# EAGLE design ptSolar (EAGLE 6.6.0)
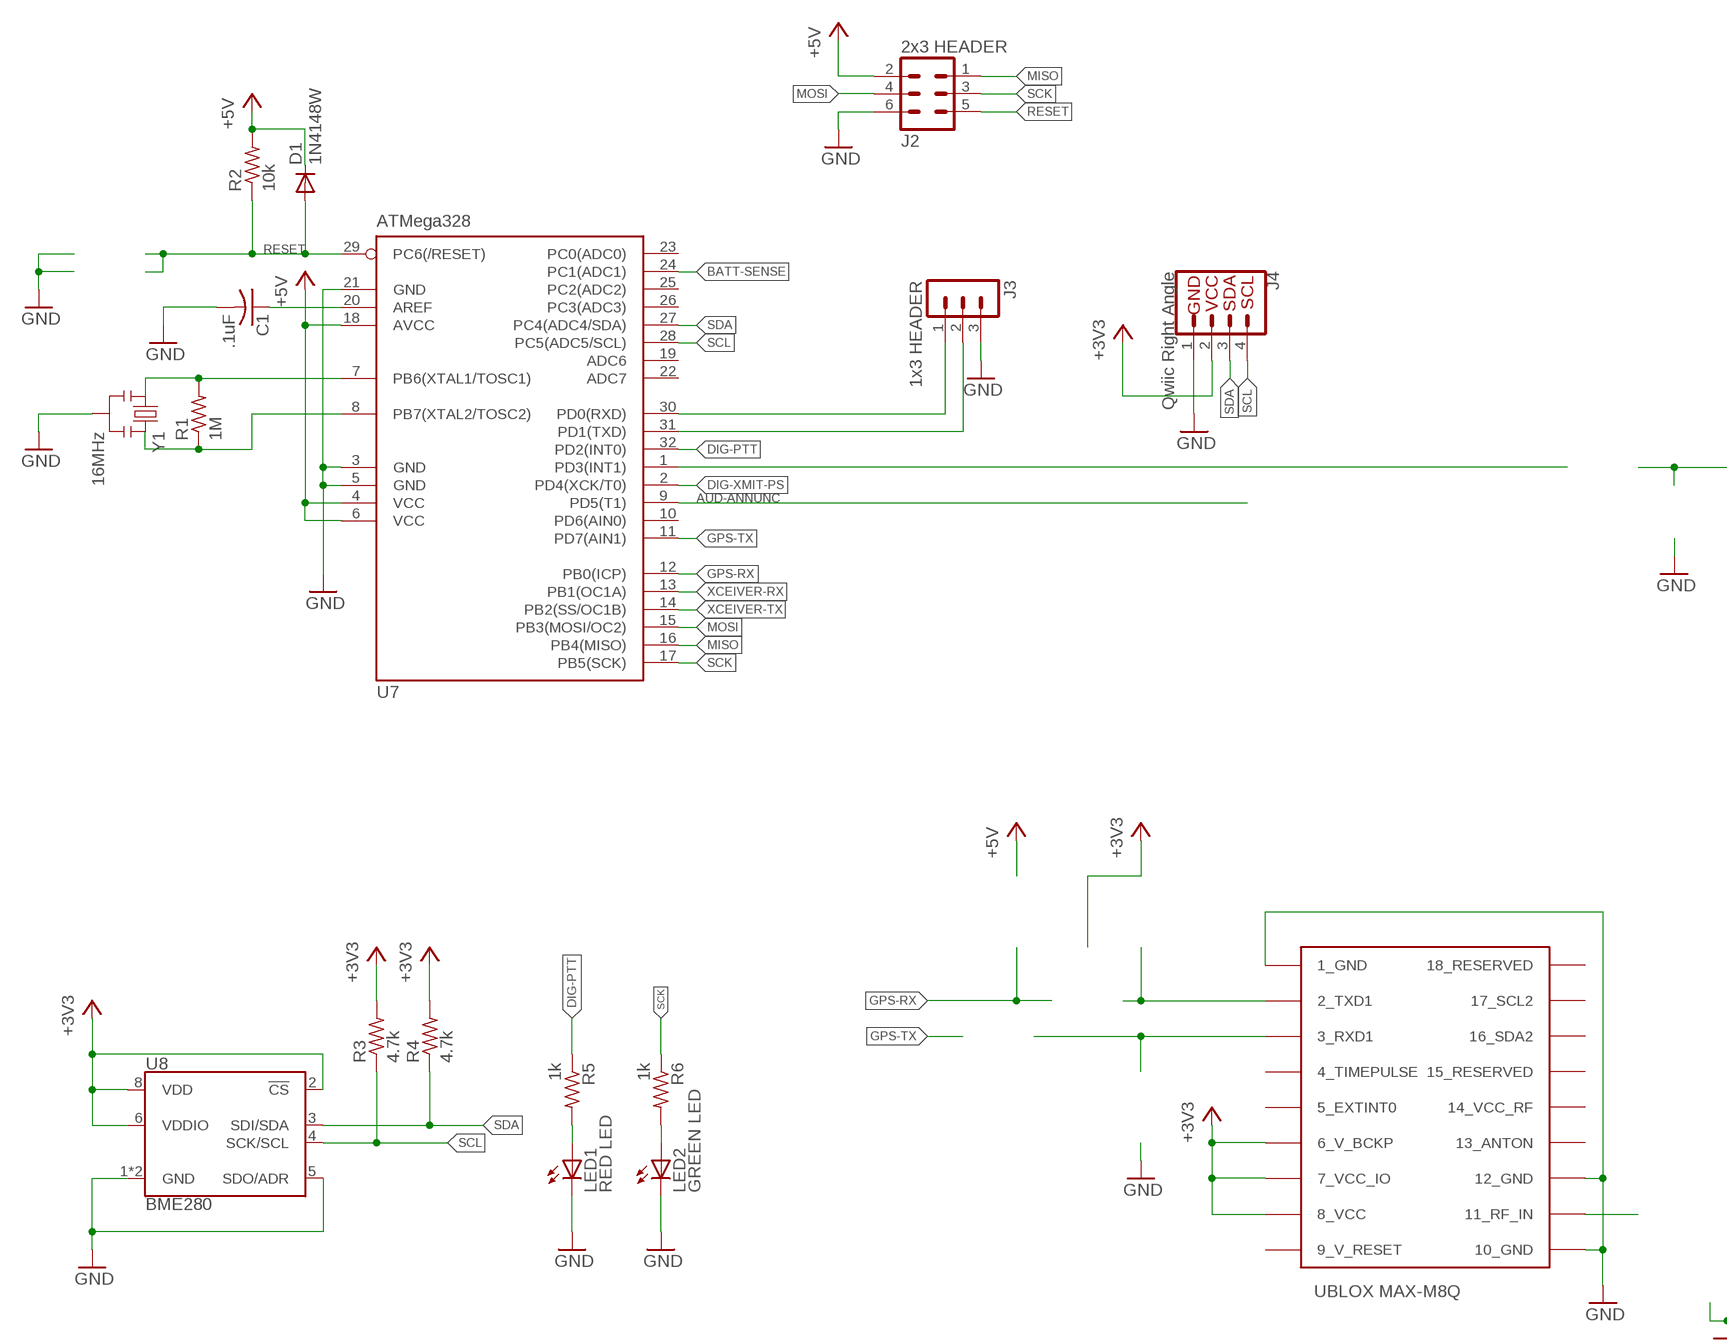
[diagram p0: schematic, sheet 1, part 1 of 2]
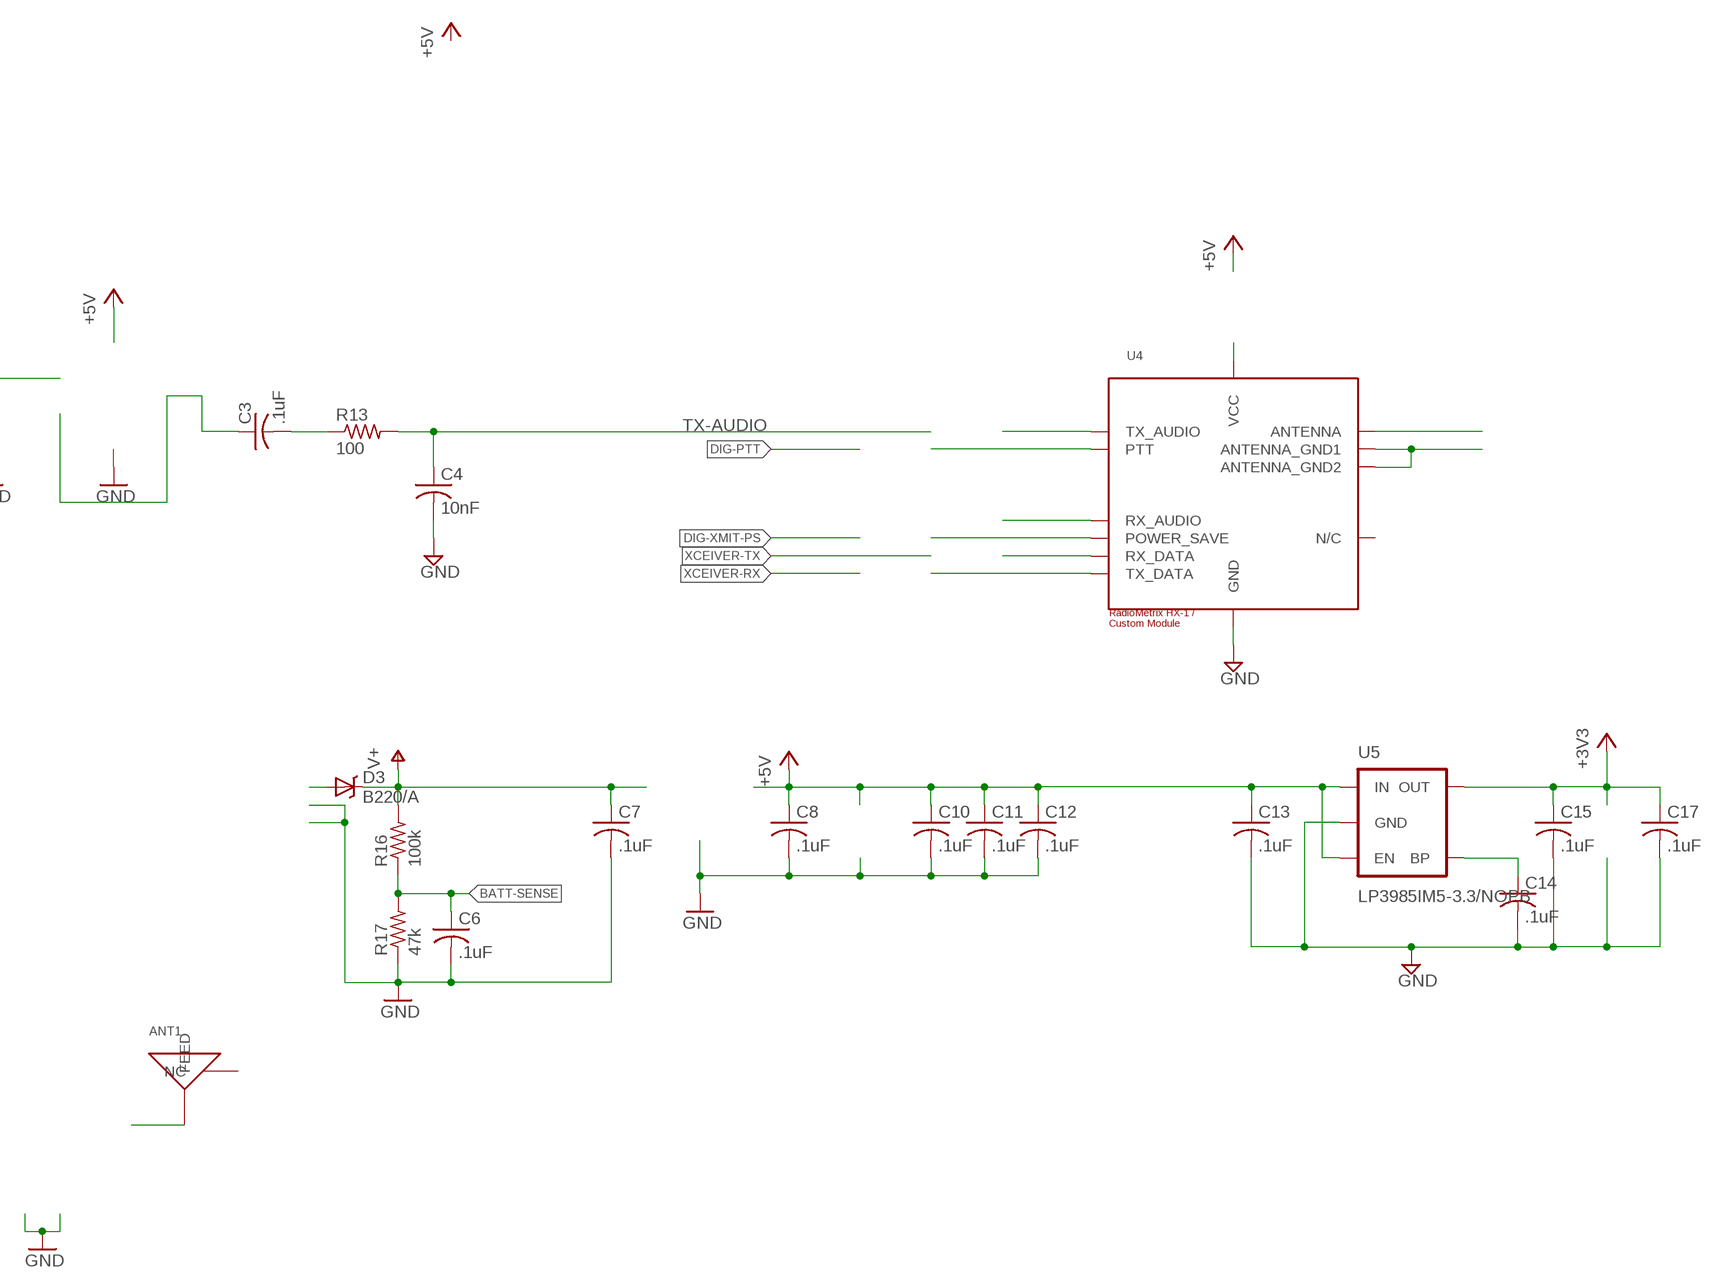
[diagram p1: schematic, sheet 1, part 2 of 2]

## Parts
ANT1  GPS ANTENNA  GPS_ANT_SMDBAR  [1575AT43A40]
C1  .1uF  C-USC0805  [C0805]
C3  .1uF  C-USC0805  [C0805]
C4  10nF  C-USC0805  [C0805]
C6  .1uF  C-USC0805  [C0805]
C7  .1uF  C-USC0805  [C0805]
C8  .1uF  C-USC0805  [C0805]
C10  .1uF  C-USC0805  [C0805]
C11  .1uF  C-USC0805  [C0805]
C12  .1uF  C-USC0805  [C0805]
C13  .1uF  C-USC0805  [C0805]
C14  .1uF  C-USC0805  [C0805]
C15  .1uF  C-USC0805  [C0805]
C17  .1uF  C-USC0805  [C0805]
D1  1N4148W  DIODE-SOD123  [SOD123]
D3  B220/A  B340A  [SMA-DIODE]
J2  2x3 HEADER  MA03-2  [MA03-2]
J3  1x3 HEADER  MA03-1  [MA03-1]
J4  Qwiic Right Angle  I2C_STANDARDQWIIC  [1X04_1MM_RA]
LED1  RED LED  LEDCHIPLED_1206  [CHIPLED_1206]
LED2  GREEN LED  LEDCHIPLED_1206  [CHIPLED_1206]
R1  1M  R-US_R0805  [R0805]
R2  10k  R-US_R0805  [R0805]
R3  4.7k  R-US_R0805  [R0805]
R4  4.7k  R-US_R0805  [R0805]
R5  1k  R-US_R0805  [R0805]
R6  1k  R-US_R0805  [R0805]
R13  100  R-US_R0805  [R0805]
R16  100k  R-US_R0805  [R0805]
R17  47k  R-US_R0805  [R0805]
U2  UBLOX_MAX  [UBLOX_MAX]
U4  RADIOMETRIX-HX1-CUSTOM  [RADIOMETRIX-HX1-CUSTOM]
U5  LP3985IM5-3.3/NOPB  V_REG_LDOSMD  [SOT23-5]
U7  ATMega328  MEGA8-AI  [TQFP32-08]
U8  BME280  [LGA-8-2.5X2.5]
Y1  16MHz  RESONATOR16MHZ  [RESONATOR-SMD]

## Nets
+3V3: C15.1 C17.1 J4.2 R3.2 R4.2 U2.6_V_BCKP U2.7_VCC_IO U2.8_VCC U5.5(OUT) U8.2(!CS) U8.6(VDDIO) U8.8(VDD)
+5V [Power]: C8.1 C10.1 C11.1 C12.1 C13.1 D1.C J2.2 R2.2 U5.1(IN) U5.3(EN) U7.4(VCC) U7.6(VCC) U7.18(AVCC)
AUD-ANNUNC: U7.9(PD5(T1))
BATT-SENSE: C6.1 R16.1 R17.2 U7.24(PC1(ADC1))
DIG-PTT: R5.1 U7.32(PD2(INT0))
DIG-XMIT-PS: U7.2(PD4(XCK/T0))
GND [Power]: C1.2 C4.2 C6.2 C7.2 C8.2 C10.2 C11.2 C12.2 C13.2 C14.2 C15.2 C17.2 J2.6 J3.3 J4.1 LED1.C LED2.C R17.1 U2.1_GND U2.10_GND U2.12_GND U4.GND U5.2(GND) U7.3(GND) U7.5(GND) U7.21(GND) U8.1(GND) U8.5(SDO/ADR) U8.7(GND) Y1.2
GPS-RX: U7.12(PB0(ICP))
GPS-TX: U7.11(PD7(AIN1))
MISO: J2.1 U7.16(PB4(MISO))
MOSI: J2.4 U7.15(PB3(MOSI/OC2))
N$2: U2.11_RF_IN
N$3: ANT1.FEED
N$4: U4.ANTENNA
N$5: U4.TX_AUDIO
N$7: U4.PTT
N$8: D3.A
N$10: C4.1 R13.2
N$11: C3.1
N$12: U4.RX_AUDIO
N$13: U7.1(PD3(INT1))
N$14: U4.POWER_SAVE
N$15: U2.2_TXD1
N$17: R1.1 U7.8(PB7(XTAL2/TOSC2)) Y1.3
N$18: U2.3_RXD1
N$19: U4.RX_DATA
N$20: U4.TX_DATA
N$23: LED1.A R5.2
N$25: LED2.A R6.2
N$59: C1.1 U7.20(AREF)
N$60: C14.1 U5.4(BP)
N$64: R1.2 U7.7(PB6(XTAL1/TOSC1)) Y1.1
RESET: D1.A J2.5 R2.1 U7.29(PC6(/RESET))
RFGND: U4.ANTENNA_GND1 U4.ANTENNA_GND2
RXD: J3.1 U7.30(PD0(RXD))
SCK: J2.3 R6.1 U7.17(PB5(SCK))
SCL: J4.4 R3.1 U7.28(PC5(ADC5/SCL)) U8.4(SCK/SCL)
SDA: J4.3 R4.1 U7.27(PC4(ADC4/SDA)) U8.3(SDI/SDA)
TX-AUDIO: C3.2 R13.1
TXD: J3.2 U7.31(PD1(TXD))
V+ [Power]: C7.1 D3.C R16.2
VCC: U4.VCC
XCEIVER-RX: U7.13(PB1(OC1A))
XCEIVER-TX: U7.14(PB2(SS/OC1B))
Unconnected: ANT1.NC U2.4_TIMEPULSE U2.5_EXTINT0 U2.13_ANTON U2.14_VCC_RF U2.15_RESERVED U2.16_SDA2 U2.17_SCL2 U2.18_RESERVED U4.N/C1(N/C) U4.N/C2(N/C) U4.N/C3(N/C) U4.N/C4(N/C) U7.10(PD6(AIN0)) U7.19(ADC6) U7.22(ADC7) U7.23(PC0(ADC0)) U7.25(PC2(ADC2)) U7.26(PC3(ADC3))

## Power pins joined to a net without a drawn wire
9_V_RESET: U2.9_V_RESET

## Library data of the parts
ANT1 = Parts:GPS_ANT_SMDBAR: 1.575 GHz GPS Antenna Johanson Technology http://www.digikey.com/product-detail/en/1575AT43A0040E/712-1003-1-ND/1560832; DIGIKEY: 712-1003-1-ND
C1 C3 C6-C8 C10-C15 C17 = resistor:C-US: CAPACITOR, American symbol; DIGIKEY: 311-1361-1-ND
C4 = resistor:C-US: CAPACITOR, American symbol; DIGIKEY: 399-1158-1-ND
D1 = custom-ds:DIODE-: DIODE; DIGIKEY: 1N4148W-FDICT-ND
D3 = SparkFun-DiscreteSemi:B340A: Schottky Diode 3A-40V; DIGIKEY: 641-1258-1-ND; PROD_ID: DIO-09886; VALUE: BA340A
J2 = con-lstb:MA03-2: PIN HEADER; DIGIKEY: 952-2121-ND; OC_FARNELL: unknown; OC_NEWARK: unknown
J3 = con-lstb:MA03-1: PIN HEADER; DIGIKEY: 952-2264-ND; OC_FARNELL: unknown; OC_NEWARK: unknown
J4 = SparkFun-Connectors:I2C_STANDARD: SparkFun I2C Standard Pinout Header SparkFun has standardized on a pinout for all I2C based sensor breakouts. This pinout allows I2C boards to be plugged directly into the headers on Arduino Uno compatible boards, and to be daisy chained easily. Example SparkFun Products: SparkFun Atmospheric Sensor Breakout - BME280 <https://www.sparkfun.com/products/13676> SparkFun Altitude/Pressure Sensor Breakout - MPL3115A2 <https://www.sparkfun.com/products/11084> SparkFun TOF Range Finder Sensor - VL6180 <https://www.sparkfun.com/products/12785>; DIGIKEY: 455-1804-1-ND; PROD_ID: CONN-13694
LED1 = led:LED: LED OSRAM: - CHIPLED LG R971, LG N971, LY N971, LG Q971, LY Q971, LO R971, LY R971 LH N974, LH R974 LS Q976, LO Q976, LY Q976 LO Q996 - Hyper CHIPLED LW Q18S LB Q993, LB Q99A, LB R99A - SideLED LS A670, LO A670, LY A670, LG A670, LP A670 LB A673, LV A673, LT A673, LW A673 LH A674 LY A675 LS A676, LA A676, LO A676, LY A676, LW A676 LS A679, LY A679, LG A679 - Hyper Micro SIDELED® LS Y876, LA Y876, LO Y876, LY Y876 LT Y87S - SmartLED LW L88C, LW L88S LB L89C, LB L89S, LG L890 LS L89K, LO L89K, LY L89K LS L896, LA L896, LO L896, LY L896 - TOPLED LS T670, LO T670, LY T670, LG T670, LP T670 LSG T670, LSP T670, LSY T670, LOP T670, LYG T670 LG T671, LOG T671, LSG T671 LB T673, LV T673, LT T673, LW T673 LH T674 LS T676, LA T676, LO T676, LY T676, LB T676, LH T676, LSB T676, LW T676 LB T67C, LV T67C, LT T67C, LS T67K, LO T67K, LY T67K, LW E67C LS E67B, LA E67B, LO E67B, LY E67B, LB E67C, LV E67C, LT E67C LW T67C LS T679, LY T679, LG T679 LS T770, LO T770, LY T770, LG T770, LP T770 LB T773, LV T773, LT T773, LW T773 LH T774 LS E675, LA E675, LY E675, LS T675 LS T776, LA T776, LO T776, LY T776, LB T776 LHGB T686 LT T68C, LB T68C - Hyper Mini TOPLED® LB M676 - Mini TOPLED Santana® LG M470 LS M47K, LO M47K, LY M47K Source: http://www.osram.convergy.de LUXEON: - LUMILED® LXK2-PW12-R00, LXK2-PW12-S00, LXK2-PW14-U00, LXK2-PW14-V00 LXK2-PM12-R00, LXK2-PM12-S00, LXK2-PM14-U00 LXK2-PE12-Q00, LXK2-PE12-R00, LXK2-PE12-S00, LXK2-PE14-T00, LXK2-PE14-U00 LXK2-PB12-K00, LXK2-PB12-L00, LXK2-PB12-M00, LXK2-PB14-N00, LXK2-PB14-P00, LXK2-PB14-Q00 LXK2-PR12-L00, LXK2-PR12-M00, LXK2-PR14-Q00, LXK2-PR14-R00 LXK2-PD12-Q00, LXK2-PD12-R00, LXK2-PD12-S00 LXK2-PH12-R00, LXK2-PH12-S00 LXK2-PL12-P00, LXK2-PL12-Q00, LXK2-PL12-R00 Source: www.luxeon.com KINGBRIGHT: KA-3528ASYC Source: www.kingbright.com; DIGIKEY: 160-1405-1-ND
LED2 = led:LED: LED OSRAM: - CHIPLED LG R971, LG N971, LY N971, LG Q971, LY Q971, LO R971, LY R971 LH N974, LH R974 LS Q976, LO Q976, LY Q976 LO Q996 - Hyper CHIPLED LW Q18S LB Q993, LB Q99A, LB R99A - SideLED LS A670, LO A670, LY A670, LG A670, LP A670 LB A673, LV A673, LT A673, LW A673 LH A674 LY A675 LS A676, LA A676, LO A676, LY A676, LW A676 LS A679, LY A679, LG A679 - Hyper Micro SIDELED® LS Y876, LA Y876, LO Y876, LY Y876 LT Y87S - SmartLED LW L88C, LW L88S LB L89C, LB L89S, LG L890 LS L89K, LO L89K, LY L89K LS L896, LA L896, LO L896, LY L896 - TOPLED LS T670, LO T670, LY T670, LG T670, LP T670 LSG T670, LSP T670, LSY T670, LOP T670, LYG T670 LG T671, LOG T671, LSG T671 LB T673, LV T673, LT T673, LW T673 LH T674 LS T676, LA T676, LO T676, LY T676, LB T676, LH T676, LSB T676, LW T676 LB T67C, LV T67C, LT T67C, LS T67K, LO T67K, LY T67K, LW E67C LS E67B, LA E67B, LO E67B, LY E67B, LB E67C, LV E67C, LT E67C LW T67C LS T679, LY T679, LG T679 LS T770, LO T770, LY T770, LG T770, LP T770 LB T773, LV T773, LT T773, LW T773 LH T774 LS E675, LA E675, LY E675, LS T675 LS T776, LA T776, LO T776, LY T776, LB T776 LHGB T686 LT T68C, LB T68C - Hyper Mini TOPLED® LB M676 - Mini TOPLED Santana® LG M470 LS M47K, LO M47K, LY M47K Source: http://www.osram.convergy.de LUXEON: - LUMILED® LXK2-PW12-R00, LXK2-PW12-S00, LXK2-PW14-U00, LXK2-PW14-V00 LXK2-PM12-R00, LXK2-PM12-S00, LXK2-PM14-U00 LXK2-PE12-Q00, LXK2-PE12-R00, LXK2-PE12-S00, LXK2-PE14-T00, LXK2-PE14-U00 LXK2-PB12-K00, LXK2-PB12-L00, LXK2-PB12-M00, LXK2-PB14-N00, LXK2-PB14-P00, LXK2-PB14-Q00 LXK2-PR12-L00, LXK2-PR12-M00, LXK2-PR14-Q00, LXK2-PR14-R00 LXK2-PD12-Q00, LXK2-PD12-R00, LXK2-PD12-S00 LXK2-PH12-R00, LXK2-PH12-S00 LXK2-PL12-P00, LXK2-PL12-Q00, LXK2-PL12-R00 Source: www.luxeon.com KINGBRIGHT: KA-3528ASYC Source: www.kingbright.com; DIGIKEY: 160-1169-1-ND
R1 = resistor:R-US_: RESISTOR, American symbol; DIGIKEY: 311-1.0MARCT-ND
R2 = resistor:R-US_: RESISTOR, American symbol; DIGIKEY: 311-10.0KCRCT-ND
R3 R4 = resistor:R-US_: RESISTOR, American symbol; DIGIKEY: 311-4.7KARCT-ND
R5 R6 = resistor:R-US_: RESISTOR, American symbol; DIGIKEY: 311-1.0KARCT-ND
R13 = resistor:R-US_: RESISTOR, American symbol; DIGIKEY: 311-100ARCT-ND
R16 = resistor:R-US_: RESISTOR, American symbol; DIGIKEY: 311-100KCRCT-ND
R17 = resistor:R-US_: RESISTOR, American symbol; DIGIKEY: 311-47.0KCRCT-ND
U2 = Ava:UBLOX_MAX: UBLOX MAX; ALT-PART: UBLOX MAX-M8Q; DIGIKEY: 672-1003-1-ND
U4 = custom-ds:RADIOMETRIX-HX1-CUSTOM
U5 = SparkFun-PowerIC:V_REG_LDO: Voltage Regulator LDO Standard 150mA LDO voltage regulator in SOT-23 layout. Micrel part MIC5205. BP (by-pass) pin is used to lower output noise with 470pF cap.; DIGIKEY: LP3985IM5-3.3/NOPBCT-ND
U7 = atmel:MEGA8: MICROCONTROLLER 8 Kbytes FLASH, 1 kbytes SRAM, 512 bytes EEPROM, USART, 6-channel 10 bit ADC, 2-channel 8 bit ADC Pin compatible with Atmega48, ATMega88, ATMega168 Source: avr.lbr; DIGIKEY: ATMEGA328P-AU-ND; MPN: ATMEGA8-16AU; OC_FARNELL: 9171371; OC_NEWARK: 73M8863
U8 = SparkFun-Sensors:BME280: Bosch BME280 – Combined Humidity and Pressure Sensor The BME280 is as combined digital humidity, pressure and temperature sensor based on proven sensing principles. The sensor module is housed in an extremely compact metal-lid LGA package with a footprint of only 2.5×2.5mm² with a height of 0.93mm. Its small dimensions and its low power consumption allow the implementation in battery driven devices such as handsets, GPS modules or watches. Datasheet <https://cdn.sparkfun.com/assets/learn_tutorials/4/1/9/BST-BME280_DS001-10.pdf> SparkFun Products SparkFun Atmospheric Sensor Breakout - BME280 <https://www.sparkfun.com/products/13676> (SEN-13676); DIGIKEY: 828-1063-1-ND; PROD_ID: IC-13090
Y1 = SparkFun-FreqCtrl:RESONATOR: Resonator Small SMD resonator. Used, eg, on the Arduino Pro/ Pro Mini boards. 8MHz- XTAL-08895 16MHz- XTAL-08900; DIGIKEY: 478-5420-1-ND; PROD_ID: XTAL-08900

## Net classes
1 Power: width 0.127 mm, clearance 0.025 mm

## Board
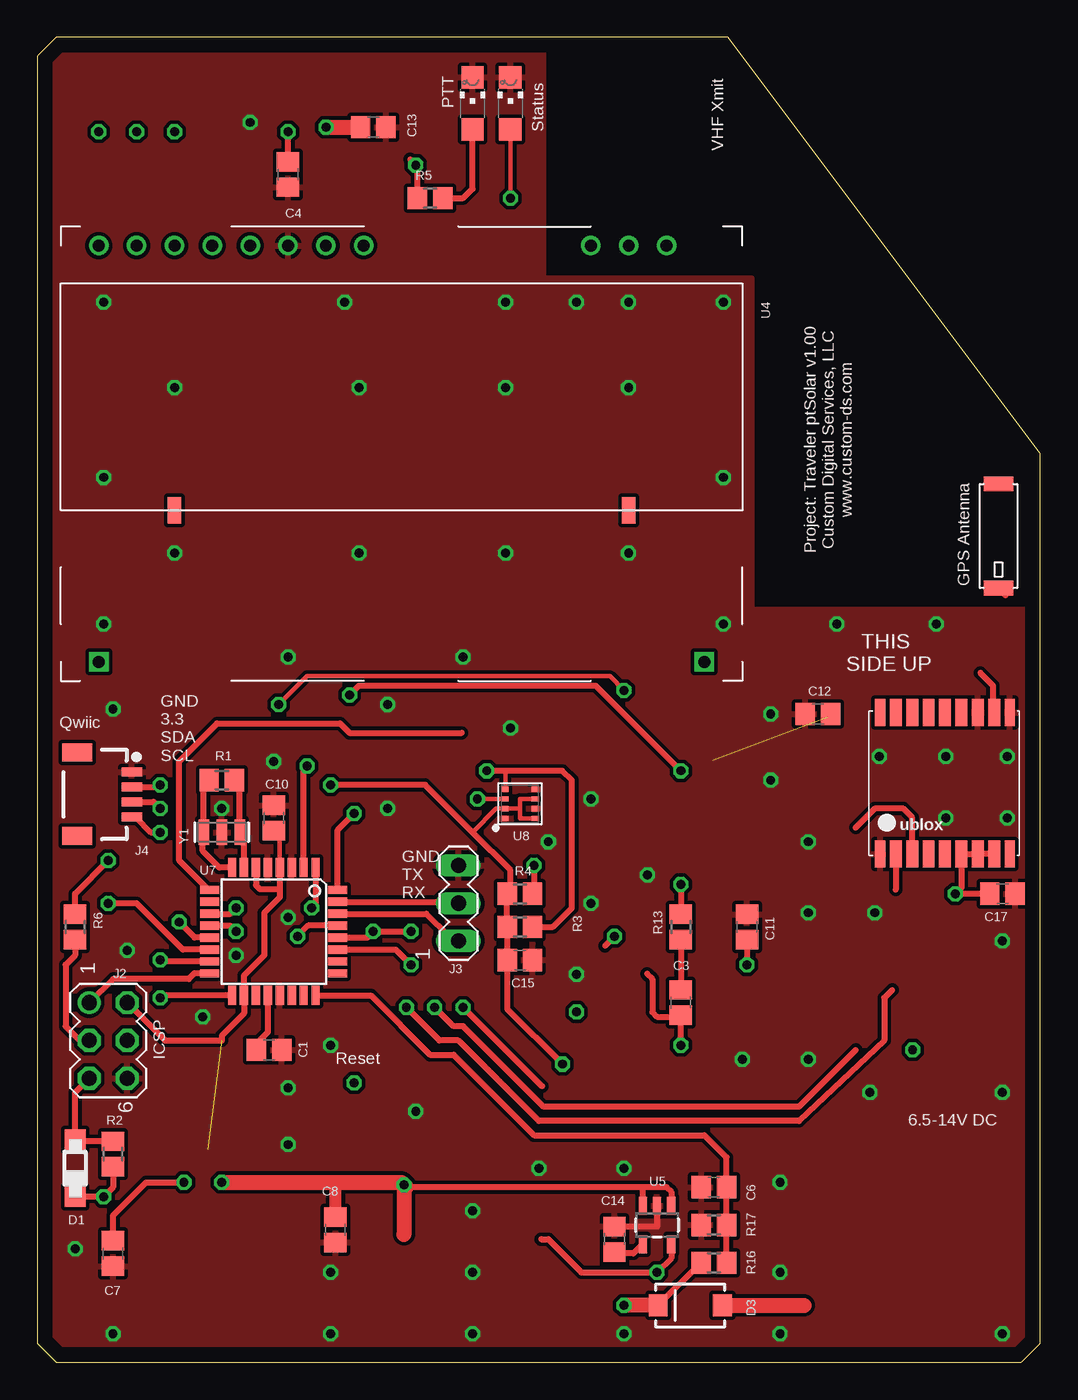
[diagram p2: board, top side]
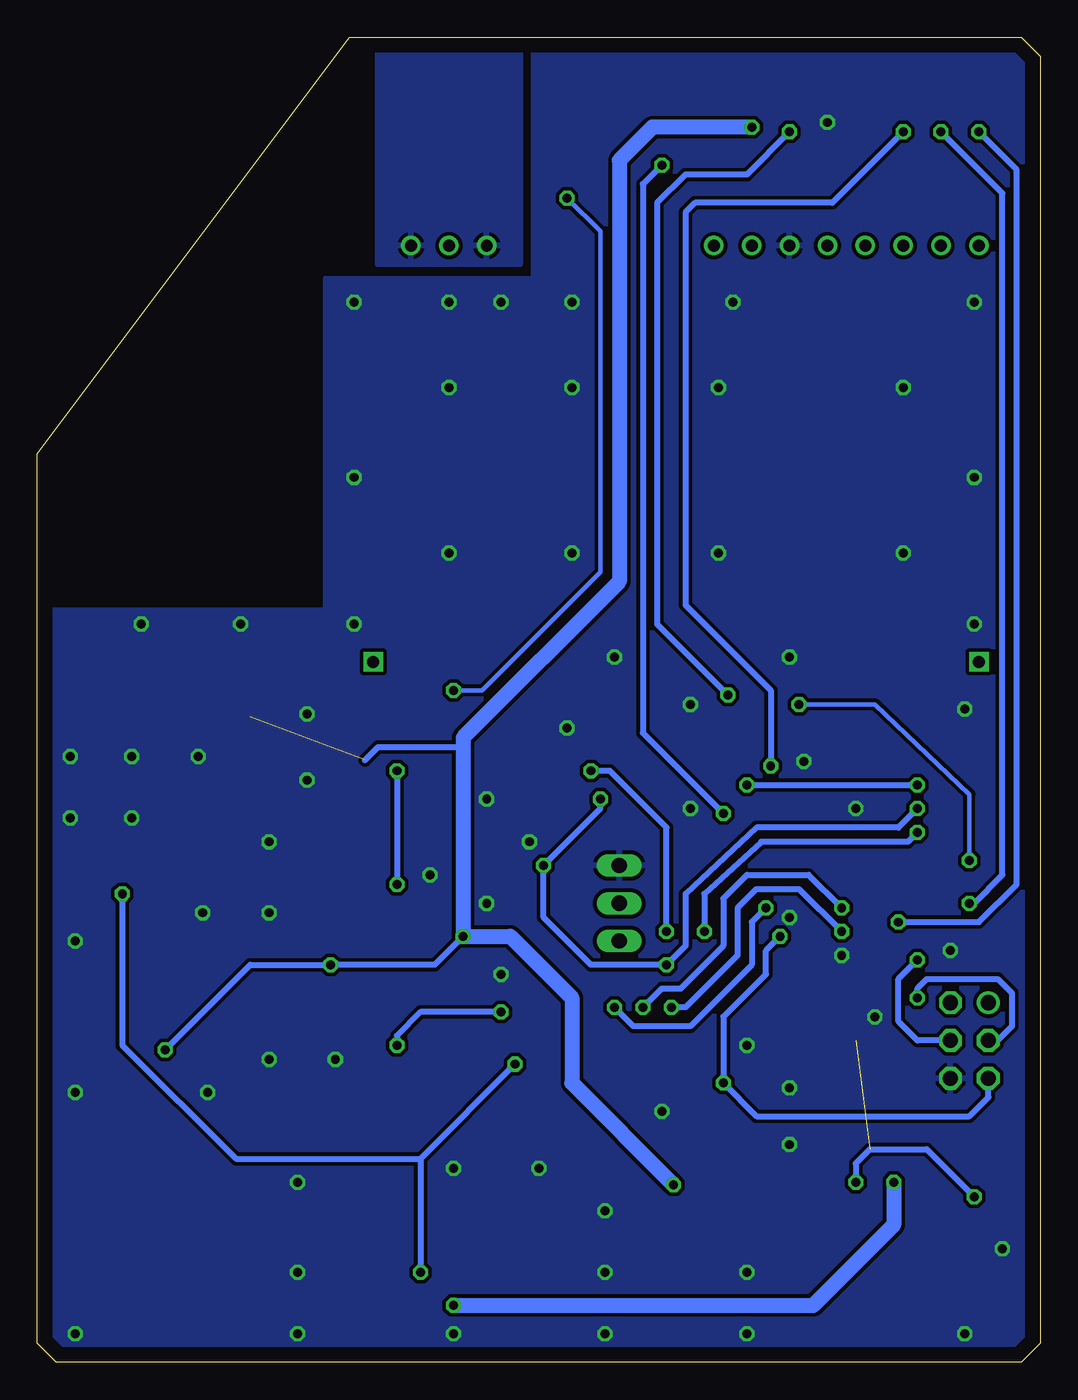
[diagram p3: board, bottom side, seen from below]

Size 67.31 x 88.9 mm. Coordinates in mm from the lower left corner, seen from the top.
Outline: 67.31,1.27 66.04,0 1.27,0 0,1.27 0,87.63 1.27,88.9 46.35,88.9 67.31,60.96 67.31,1.27
Copper layers (1*16): Top 0.035mm / dielectric 1.5mm / Bottom 0.035mm
Design rules "default *": minimum track width 10mil, minimum drill 23mil, track to track 10mil, track to pad 10mil, pad to pad 8mil, via to via 10mil, smd to smd 8mil, copper to edge 40mil, drill to drill 8mil, minimum pad ring 10mil, minimum via ring 8mil, stop-mask expansion 4mil, vias tented up to drill 0mil, thermal gap 10mil

### Footprints (pad centres in the part's own frame; a part is rotated, then mirrored left to right if it is on the bottom)
1575AT43A40 = smd 1 x 2: FEED 0.5,-1; NC 7.5,-1
C0805 = smd 1.3 x 1.5: 1 -0.85,0; 2 0.85,0
SOD123 = smd 1.4 x 1.4: A 1.9,0; C -1.9,0
SMA-DIODE = smd 1.27 x 1.47: A -2.15,0; C 2.15,0
MA03-2 = drill 1.016: 1 -2.54,-1.27 | drill 1.016 octagon: 2 -2.54,1.27; 3 0,-1.27; 4 0,1.27; 5 2.54,-1.27; 6 2.54,1.27
MA03-1 = drill 1.016 long: 1 -2.54,0; 2 0,0; 3 2.54,0
1X04_1MM_RA = smd 0.6 x 1.35: 1 -1.5,0; 2 -0.5,0; 3 0.5,0; 4 1.5,0 | smd 1.2 x 2: NC1 2.8,-3.675; NC2 -2.8,-3.675
CHIPLED_1206 = smd 1.5 x 1.5: A 0,-1.75; C 0,1.75
R0805 = smd 1.3 x 1.5: 1 -0.85,0; 2 0.85,0
UBLOX_MAX = smd 1.8 x 0.7: 1_GND 4.95,-4.4; 9_V_RESET 4.95,4.3; 10_GND -4.55,4.3; 18_RESERVED -4.55,-4.4 | smd 1.8 x 0.8: 2_TXD1 4.95,-3.35; 3_RXD1 4.95,-2.25; 4_TIMEPULSE 4.95,-1.15; 5_EXTINT0 4.95,-0.05; 6_V_BCKP 4.95,1.05; 7_VCC_IO 4.95,2.15; 8_VCC 4.95,3.25; 11_RF_IN -4.55,3.25; 12_GND -4.55,2.15; 13_ANTON -4.55,1.05; 14_VCC_RF -4.55,-0.05; 15_RESERVED -4.55,-1.15; 16_SDA2 -4.55,-2.25; 17_SCL2 -4.55,-3.35
RADIOMETRIX-HX1-CUSTOM = drill 0.8: ANTENNA -15.24,-12.7; ANTENNA_GND1 -17.78,-12.7; ANTENNA_GND2 -12.7,-12.7; GND 7.62,-12.7; POWER_SAVE 15.24,-12.7; PTT 2.54,-12.7; RX_AUDIO 12.7,-12.7; RX_DATA 17.78,-12.7; TX_AUDIO 10.16,-12.7; TX_DATA 20.32,-12.7; VCC 5.08,-12.7 | smd 0.914 x 1.778: N/C1 -15.24,5.08; N/C2 15.24,5.08 | drill 0.8 square: N/C3 -20.32,15.24; N/C4 20.32,15.24
SOT23-5 = smd 0.55 x 1.2: 1 -0.95,-1.3; 2 0,-1.3; 3 0.95,-1.3; 4 0.95,1.3; 5 -0.95,1.3
TQFP32-08 = smd 1.27 x 0.559: 1 -4.293,2.8; 2 -4.293,2; 3 -4.293,1.2; 4 -4.293,0.4; 5 -4.293,-0.4; 6 -4.293,-1.2; 7 -4.293,-2; 8 -4.293,-2.8; 17 4.293,-2.8; 18 4.293,-2; 19 4.293,-1.2; 20 4.293,-0.4; 21 4.293,0.4; 22 4.293,1.2; 23 4.293,2; 24 4.293,2.8 | smd 0.559 x 1.27: 9 -2.8,-4.293; 10 -2,-4.293; 11 -1.2,-4.293; 12 -0.4,-4.293; 13 0.4,-4.293; 14 1.2,-4.293; 15 2,-4.293; 16 2.8,-4.293; 25 2.8,4.293; 26 2,4.293; 27 1.2,4.293; 28 0.4,4.293; 29 -0.4,4.293; 30 -1.2,4.293; 31 -2,4.293; 32 -2.8,4.293
LGA-8-2.5X2.5 = smd 0.35 x 0.5: 1 -0.975,1.025; 2 -0.325,1.025; 3 0.325,1.025; 4 0.975,1.025; 5 0.975,-1.025; 6 0.325,-1.025; 7 -0.325,-1.025; 8 -0.975,-1.025
RESONATOR-SMD = smd 0.7 x 1.7: 1 -1.2,0; 2 0,0; 3 1.2,0

### Placement (x,y rotation side)
ANT1  63.5,51.44 90 top
C1  15.56,20.95 0 top
C3  43.18,24.13 90 top
C4  16.83,79.69 270 top
C6  45.4,11.75 180 top
C7  5.08,7.3 270 top
C8  20,8.89 270 top
C10  15.88,36.51 90 top
C11  47.62,29.21 90 top
C12  52.39,43.5 180 top
C13  22.54,82.87 0 top
C14  38.73,8.26 90 top
C15  32.38,26.99 0 top
C17  64.77,31.43 0 top
D1  2.54,13.02 90 top
D3  43.81,3.81 180 top
J2  4.76,21.59 270 top
J3  28.26,30.8 90 top
J4  6.35,38.1 270 top
LED1  29.21,84.45 0 top
LED2  31.75,84.45 0 top
R1  12.38,39.05 0 top
R2  5.08,13.97 270 top
R3  32.38,29.21 180 top
R4  32.38,31.43 180 top
R5  26.35,78.11 0 top
R6  2.54,29.21 90 top
R13  43.18,29.21 90 top
R16  45.4,6.67 180 top
R17  45.4,9.21 0 top
U2  60.96,39.05 270 top
U4  24.45,62.23 180 top
U5  41.59,9.21 180 top
U7  15.88,28.89 270 top
U8  32.38,37.47 90 top
Y1  12.38,35.56 180 top

### Tracks (layer width: path | path; a pad name or v marks a point on that pad's centre or on a via)
+3V3  (via drill 0.6)
  Top 0.305: 31.75,31.65 R4.2 | U8.6 32.38,37.78 32.38,37.14 | U8.8 32.38,36.49 32.38,37.14 | 32.38,37.14 U8.2 30.79,37.14 29.21,35.56
  Top 0.406: U5.5 42.54,6.98 v41.59,6.03 36.51,6.03 34.29,8.26 33.81,8.26 | U2.8_VCC U2.7_VCC_IO U2.6_V_BCKP 62.01,31.85 v61.59,31.43 C17.1 | R4.2 R3.2 C15.1 31.54,23.71 v35.24,20 | J4.2 8.12,38.6 v8.26,38.73 | 31.75,31.65 31.75,33.02 29.21,35.56 26.04,38.73 v19.68,38.73
  Bottom 0.406: v61.59,31.43 61.59,21.27 53.98,13.65 41.59,13.65 | v35.24,20 41.59,13.65 | 41.59,13.65 v41.59,6.03 | v19.68,38.73 v8.26,38.73
+5V  (via drill 0.6)  (2 unrouted)
  Top 0.305: U7.4 16.27,35.43 C10.1
  Top 0.406: U5.1 42.55,11.43 42.23,11.75 40.64,11.75 | U7.4 16.27,31.75 | 16.27,31.75 16.27,31.2 15.24,30.16 15.24,27.3 13.88,25.94 U7.18 13.88,23.4 12.38,21.91 12.38,21.59 8.57,21.59 J2.2 | U7.6 14.68,32 14.92,31.75 16.27,31.75 | 38.1,27.94 v38.73,28.57 | C11.1 v47.62,26.67 | 40.64,11.75 24.77,11.75 | U5.3 40.64,11.74 40.64,11.75 | 53.02,43.28 C12.1 | R2.2 5.08,11.75 v4.45,11.11 v4.44,11.12 D1.C
  Top 0.813: C8.1 20,12.06
  Top 1.016: v12.38,12.06 20,12.06 24.45,12.06 v24.61,11.91 | v24.61,11.91 24.77,11.75 | v24.61,11.91 24.61,8.57 | v19.37,82.87 C13.1
  Bottom 0.406: v12.38,12.06 12.38,13.34 11.43,14.29 7.62,14.29 v4.45,11.11 | 38.81,41.98 38.73,41.91 | v58.74,20.95 53.02,26.67 v47.62,26.67 40.64,26.67 v38.73,28.57 | 45.33,40.4 44.45,41.27 39.05,41.27 38.73,40.96
  Bottom 1.016: v19.37,82.87 26.04,82.87 28.26,80.64 28.26,52.39 38.73,41.91 38.73,40.96 v38.73,28.57 35.56,28.57 31.43,24.45 31.43,18.73 v24.61,11.91
AUD-ANNUNC
  Top 0.406: U7.9 11.49,31.69 9.53,33.66 9.53,40.32 12.06,42.86 20.32,42.86 20.95,42.23 28.47,42.23
BATT-SENSE
  Top 0.406: U7.24 22.39,24.6 26.35,20.64 27.94,20.64 33.34,15.24 44.77,15.24 46.25,13.76 C6.1 R17.2 R16.1
DIG-PTT  (via drill 0.6)
  Top 0.406: 25.02,80.71 v25.4,80.33 25.5,80.22 R5.1 | U7.32 20.17,35.73 v21.27,36.83
  Bottom 0.406: v25.4,80.33 26.67,79.06 26.67,42.23 v21.27,36.83
DIG-XMIT-PS  (via drill 0.6)
  Top 0.406: U7.2 17.88,39.78 v18.1,40.01
  Bottom 0.406: v18.1,40.01 18.1,45.09 23.81,50.8 23.81,77.15 23.18,77.79 13.97,77.79 v9.21,82.55
GND  (via drill 0.6)
  Top 0.406: C14.2 41.59,9.11 U5.2
  other vias: 46.04,59.37 31.43,71.12 31.43,65.41 4.45,59.37 21.59,65.41 21.59,54.29 39.69,71.12 9.21,54.29 28.57,47.31 16.83,47.31 31.43,54.29 13.34,27.3 39.69,65.41 46.04,71.12 4.45,49.53 60.96,40.64 36.2,71.12 46.04,49.53 29.21,10.16 20.64,71.12 9.21,65.41 65.09,36.51 49.21,43.5 33.66,13.02 23.5,44.13 37.15,30.8 56.2,30.16 64.77,18.1 40.96,32.7 51.75,30.16 31.75,42.55 51.75,34.92 5.08,43.81 49.85,1.91 64.77,1.91 39.37,1.91 29.21,1.91 19.68,1.91 5.08,1.91 19.68,6.03 29.21,6.03 49.85,6.03 12.38,37.15 16.83,29.84 64.77,28.26 6.03,27.62 25.4,16.83 16.83,14.61 19.68,21.27 2.54,7.62 55.88,18.1 51.75,20.32 49.21,39.05 14.29,83.19 39.69,54.29 15.88,40.32 23.5,37.15 65.09,40.64 34.29,34.92 56.52,40.64 11.11,23.18 16.83,18.41 36.2,26.04 47.31,20.32 49.85,12.06 39.37,13.02 4.45,71.12 60.96,36.51 37.15,37.78 53.66,49.53 60.33,49.53
  pour Bottom (isolate 0.254): 0.32,1.59 1.59,0.32 66.04,0.32 66.99,1.27 66.99,50.48 47.94,50.48 47.94,72.71 33.97,72.71 33.97,88.58 1.59,88.58 0.32,87.31
  pour Top (isolate 0.254): 66.99,50.48 47.94,50.48 47.94,72.71 33.97,72.71 33.97,88.58 1.59,88.58 0.32,87.31 0.32,1.59 1.59,0.32 66.04,0.32 66.99,1.27
GPS-RX  (via drill 0.6)
  Top 0.406: U7.12 12.94,29.29 v13.34,28.89 | 57.37,24.98 56.83,24.45 56.83,21.59 51.12,16.19 33.66,16.19 28.26,21.59 26.99,21.59 v24.77,23.81
  Bottom 0.406: v13.34,28.89 16.19,31.75 19.05,31.75 20.32,30.48 20.32,27.3 23.81,23.81 v24.77,23.81
GPS-TX  (via drill 0.6)
  Top 0.406: U7.11 12.95,30.09 v13.34,30.48 | 54.93,20.95 51.12,17.14 33.97,17.14 28.57,22.54 27.94,22.54 v26.67,23.81
  Bottom 0.406: v13.34,30.48 15.56,32.7 19.68,32.7 21.27,31.11 21.27,27.94 24.13,25.08 25.4,25.08 v26.67,23.81
MISO
  Top 0.406: U7.16 10.54,26.09 10.16,25.72 5.08,25.72 J2.1
MOSI  (via drill 0.6)
  Top 0.406: U7.15 8.35,26.89 v8.26,26.99
  Bottom 0.406: J2.4 8.26,21.59 9.53,22.86 9.53,25.72 v8.26,26.99
N$2
  Top 0.406: 64.22,43.62 U2.11_RF_IN 64.14,43.68 64.14,45.4 63.28,46.25
N$3
  Top 0.406: 64.98,51.45 ANT1.FEED
N$8
  Top 1.016: D3.A 51.45,3.81
N$10  (via drill 0.6)
  Top 0.406: 16.66,80.71 C4.1 v16.83,82.55 | v20.95,44.77 21.59,45.4 37.47,45.4 v43.18,39.69 | v43.18,32.07 R13.2
  Bottom 0.406: v16.83,82.55 19.68,79.69 23.81,79.69 25.72,77.79 25.72,49.53 v20.95,44.77 | v43.18,39.69 v43.18,32.07
N$11  (via drill 0.6)
  Top 0.406: 40.92,26.07 41.27,25.72 41.27,23.5 41.59,23.18 43.08,23.18 C3.1 v43.18,21.27 | 36.23,23.46 v36.2,23.5
  Bottom 0.406: v36.2,23.5 41.59,23.5 43.18,21.91 v43.18,21.27
N$13  (via drill 0.6)
  Top 0.406: U7.1 18.68,30.74 v18.41,30.48 | 33.87,18.52 v28.57,23.81
  Bottom 0.406: v18.41,30.48 19.37,29.53 19.37,26.67 23.5,22.54 27.3,22.54 v28.57,23.81
N$15
  Top 0.406: U2.2_TXD1 57.61,31.71
N$17
  Top 0.406: U7.8 12.22,33.19 11.11,34.29 11.11,35.49 Y1.3 11.18,38.7 R1.1
N$18
  Top 0.406: U2.3_RXD1 58.71,36.54 58.1,37.15 56.2,37.15 54.93,35.88
N$23
  Top 0.406: R5.2 28.57,78.11 29.21,78.74 LED1.A
N$25  (via drill 0.6)
  Top 0.305: v16.19,44.13 18.1,46.04 38.42,46.04 v39.37,45.09 | LED2.A v31.75,78.11
  Top 0.406: R6.2 2.54,31.43 v4.76,33.66
  Bottom 0.305: v4.76,33.66 4.76,38.1 11.11,44.13 v16.19,44.13 | v31.75,78.11 29.53,75.88 29.53,53.02 37.47,45.09 v39.37,45.09
N$59
  Top 0.406: U7.20 15.47,22.14 14.92,21.59 14.92,21.17 C1.1
N$60
  Top 0.406: U5.4 40.61,7.91 40.01,7.3 38.84,7.3 C14.1
N$64
  Top 0.406: U7.7 13.88,35.27 Y1.1 13.58,38.7 R1.2
RESET  (via drill 0.6)
  Top 0.406: U7.29 18.18,29.29 v17.46,28.57 | J2.5 2.54,18.1 D1.A 2.64,14.82 R2.1
  Bottom 0.406: J2.5 3.49,17.78 4.76,16.51 19.05,16.51 v21.27,18.73 21.27,23.18 18.41,26.04 18.41,27.62 v17.46,28.57
RFGND
  pour Bottom: 34.92,88.58 34.92,73.66 44.45,73.66 44.45,88.58
RXD
  Top 0.406: U7.30 26.11,30.09 27.62,28.57 27.94,28.57 J3.1
SCK  (via drill 0.6)
  Top 0.406: U7.17 8.41,24.6 v8.26,24.45 | R6.1 2.54,27.3 1.91,26.67 1.91,22.54 2.86,21.59 J2.3
  Bottom 0.406: v8.26,24.45 8.26,25.08 7.62,25.72 2.86,25.72 1.91,24.77 1.91,22.54 2.86,21.59 J2.3
SCL  (via drill 0.6)
  Top 0.305: U8.4 31.43,38.51 31.43,39.69
  Top 0.406: J4.4 6.35,36.51 6.67,36.51 7.62,35.56 v8.26,35.56 | v25.08,28.89 v22.54,28.89 22.14,28.49 U7.28 | R3.1 34.61,29.21 35.88,30.48 35.88,39.05 35.24,39.69 31.43,39.69 v30.16,39.69
  Bottom 0.406: v30.16,39.69 28.89,39.69 25.08,35.88 v25.08,28.89 | v8.26,35.56 8.89,34.92 18.73,34.92 22.54,31.43 v22.54,28.89
SDA  (via drill 0.6)
  Top 0.305: U8.3 v29.54,37.79 v29.53,37.78
  Top 0.406: U7.27 24.06,27.69 v25.08,26.67 | J4.3 7.8,37.6 v8.26,37.15 | v33.34,33.34 33.34,31.54 R4.1
  Bottom 0.406: v8.26,37.15 9.53,35.88 19.05,35.88 23.81,31.43 23.81,27.94 v25.08,26.67 30.16,26.67 33.34,29.84 v33.34,33.34 29.53,37.15 v29.53,37.78
TX-AUDIO
  Top 0.406: R13.1 C3.2
TXD
  Top 0.406: U7.31 28.16,30.89 J3.2
V+  (via drill 0.6)
  Top 0.406: R16.2 44.52,6.67 D3.C | C7.1 5.08,9.84 7.3,12.06 v9.84,12.06
  Top 1.016: D3.C v39.37,3.81
  Bottom 1.016: v39.37,3.81 15.24,3.81 9.84,9.21 v9.84,12.06
XCEIVER-RX  (via drill 0.6)
  Top 0.406: U7.13 10.56,28.49 v9.53,29.53
  Bottom 0.406: v9.53,29.53 4.13,29.53 1.59,32.07 1.59,80.01 v4.13,82.55
XCEIVER-TX  (via drill 0.6)
  Top 0.406: U7.14 9.77,27.69 6.67,30.8 v4.76,30.8
  Bottom 0.406: v4.76,30.8 4.45,30.8 2.54,32.7 2.54,78.42 v6.67,82.55

### Text on the board
tNames: PTT | Status | VHF Xmit | Project: Traveler ptSolar v1.00 / Custom Digital Services, LLC / www.custom-ds.com | GPS Antenna | THIS / SIDE UP | Qwiic | GND / 3.3 / SDA / SCL | GND / TX / RX | ICSP | Reset | 6.5-14V DC